# Altium project Vixen.PrjPcb
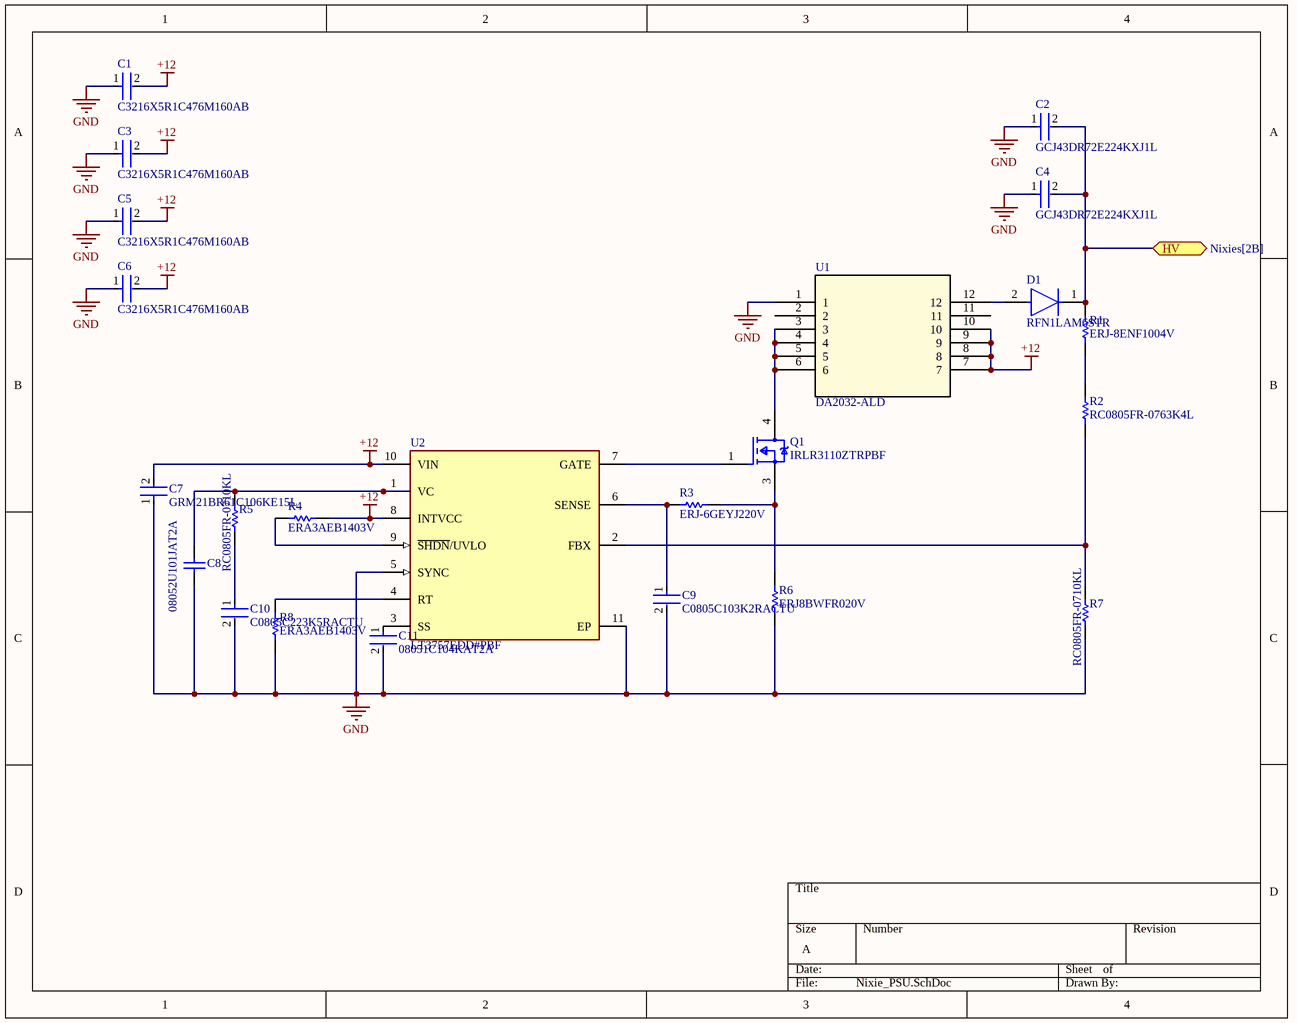
[diagram p0: Nixie_PSU.SchDoc]
5 sheets, 90 parts. Net scope: flat (ports and power ports of the same name join across sheets).
Board file: Vixen.PcbDoc
Sheets:
  Nixie_PSU.SchDoc
  Connectors.SchDoc
  Power.SchDoc
  Nixies.SchDoc
  ESP32.SchDoc

## Sheet Nixie_PSU.SchDoc
size A; SheetNumber: 1; SheetTotal: 5

### Parts
C1  C3216X5R1C476M160AB  [FP-C3216-160-0_2-MFG]
C2  GCJ43DR72E224KXJ1L  [FP-GCJ43D-0_4-IPC_C]
C3  C3216X5R1C476M160AB  [FP-C3216-160-0_2-MFG]
C4  GCJ43DR72E224KXJ1L  [FP-GCJ43D-0_4-IPC_C]
C5  C3216X5R1C476M160AB  [FP-C3216-160-0_2-MFG]
C6  C3216X5R1C476M160AB  [FP-C3216-160-0_2-MFG]
C7  GRM21BR61C106KE15L  [FP-GRM21B-0_1-IPC_C]
C8  08052U101JAT2A  [CAPC2013X115X51ML20T26]
C9  C0805C103K2RACTU  [FP-C0805C-DN-MFG]
C10  C0805C223K5RACTU  [FP-C0805C-DN-MFG]
C11  08051C104KAT2A  [FP-0805-L_2_01_0_2-W_1_25-IPC_B]
D1  RFN1LAM6STR  [FP-PMDTM-MFG]
Q1  IRLR3110ZTRPBF  [FP-PG-TO252-3-MFG]
R1  ERJ-8ENF1004V  [RESC3216X70X50NL05T20]
R2  RC0805FR-0763K4L  [RESC2013X60X35NL10T20]
R3  ERJ-6GEYJ220V  [RESC2013X70X40ML20T20]
R4  ERA3AEB1403V  [RESC1608X55X30LL20T20]
R5  RC0805FR-0710KL  [RESC2013X60X35NL10T20]
R6  ERJ8BWFR020V  [RESC3216X70X50LL05T20]
R7  RC0805FR-0710KL  [RESC2013X60X35NL10T20]
R8  ERA3AEB1403V  [RESC1608X55X30LL20T20]
U1  DA2032-ALD  [SOIC12_LT3750_DA2032_14P98X17P2_COC]
U2  LT3757EDD#PBF  [FP-DD-10-05-08-1699-IPC_A]

### Ports
HV (bidir, see Nixies[2B])

### Nets
+12: C1.2 C3.2 C5.2 C6.2 C7.2 R4.1 U1.7 U1.8 U1.9 U1.10 U2.8(INTVCC) U2.10(VIN)
GND: C1.1 C2.1 C3.1 C4.1 C5.1 C6.1 C7.1 C8.1 C9.2 C10.2 C11.2 R6.1 R7.1 R8.2 U1.1 U2.5(SYNC) U2.11(EP)
NetC2_2: C2.2 C4.2 D1.1(C) R1.2 ; port HV
NetC8_2: C8.2 R5.2 U2.1(VC)
NetC9_1: C9.1 R3.1 U2.6(SENSE)
NetC10_1: C10.1 R5.1
NetC11_1: C11.1 U2.3(SS)
NetD1_2: D1.2(A) U1.12
NetQ1_1: Q1.1(G) U2.7(GATE)
NetQ1_3: Q1.3(S) R3.2 R6.2
NetQ1_4: Q1.4(D) U1.3 U1.4 U1.5 U1.6
NetR1_1: R1.1 R2.2
NetR2_1: R2.1 R7.2 U2.2(FBX)
NetR4_2: R4.2 U2.9(~{SHDN}/UVLO)
NetR8_1: R8.1 U2.4(RT)

Not connected (* = marked no-connect by the designer): U1 2 11

### Library data of the parts
C1 C3 C5 C6 = CMP-2000-07442-2: Multilayer Ceramic Capacitors 47uF ±20% 16V X5R SMD 1206; Resistor Type: Ceramic; Width: 0.063inch; Case Code (Imperial): 1206; Radiation Hardening: No; Thickness: 0.071inch; Dielectric: X5R; Weight: 0.000571oz; Termination: SMD/SMT; Dielectric Material: Ceramic; Min Operating Temperature: -55°C; Depth: 1.6mm; Case Code (Metric): 3216; Max Operating Temperature: 85°C; RoHS Compliant: Yes; REACH SVHC: No SVHC; Mount: Surface Mount; Lead Free: Lead Free; Height: 1.6mm; Length: 3.2mm; Tolerance: 20%; Voltage Rating (DC): 16V; Capacitance: 47uF; Package Quantity: 1; Construction: Flat; Packaging: Tape and Reel; Series: C; Case/Package: 1206; Voltage Rating: 16V
C2 C4 = CMP-06035-007963-1: 0.22uF ±10% 250V Ceramic Capacitor X7R 1812 (4532 Metric); Capacitance: 220nF; Ratings: AEC-Q200; Dielectric: X7R; Voltage Rating: 250V; Termination: SMD/SMT; Tolerance: 10%; Width: 0.126inch; Length: 4.5mm; Radiation Hardening: No; Case Code (Metric): 4532; Voltage Rating (DC): 250V; Depth: 3.2mm; Features: Soft Termination; Mount: Surface Mount; Thickness: 0.079inch; REACH SVHC: No SVHC; Max Operating Temperature: 125°C; Package Quantity: 1; Case Code (Imperial): 1812; Min Operating Temperature: -55°C; Packaging: Tape and Reel; Case/Package: 1812; Height: 2mm
C7 = CMP-2007-03453-2: Chip Multilayer Ceramic Capacitors for General Purpose, 0805, 10uF, X5R, 15%, 10%, 16V; Radiation Hardening: No; Thickness: 0.053inch; Voltage Rating (DC): 16V; Lead Free: Lead Free; Package Quantity: 1; Width: 1.25mm; Case Code (Imperial): 0805; Depth: 1.25mm; Packaging: Tape and Reel; Dielectric: X5R; Max Operating Temperature: 85°C; Tolerance: 10%; Voltage Rating: 16V; Voltage: 16V; Capacitance: 10uF; Height: 1.25mm; Case Code (Metric): 2012; Material: Ceramic; Mount: Surface Mount; Case/Package: 0805; REACH SVHC: No SVHC; Length: 2mm; Min Operating Temperature: -55°C; Termination: SMD/SMT
C8 = CMP-2007-04861-1: Manufacturer: AVX Interconnect / Elco; Part Number: 08052U101JAT2A
C9 = CMP-2007-00259-2: CAP CER 10000PF 200V X7R 0805; Manufacturer: KEMET; Material: Ceramic; Temperature Coefficient: 30ppm/°C; Capacitance: 10,000 pF; Tolerance: 0.1; Value: 10,000 pF; Device Class L2: Capacitors; Voltage Rating: 200 V; Temperature Range High: +125°C; ComponentLink2Description: Datasheet; Height: 0.88mm; Octopart: https://octopart.com/c0805c103k2ractu-kemet-9138347; ComponentLink2URL: https://content.kemet.com/datasheets/KEM_C1003_C0G_SMD.pdf; Category: Cap; Temperature: -55°C to +125°C; Temperature Range Low: -55°C; Digikey Description: CAP CER 10000PF 200V X7R 0805; Manufacturer Part Number: C0805C103K2RACTU; Temperature Characteristic: X7R; Automotive: No; Device Class L3: Ceramic Capacitors; Mouser Description: KEMET - C0805C103K2RACTU - CAP, MLCC, X7R, 10NF, 200V, 0805; RoHS: TRUE; Device Class L1: Passive Components; Lead Free: Yes; Package: C0805C-DN; Ipc Land Pattern Name: CAPC200125X78
C10 = CMP-2007-00338-2: CAP CER 0.022UF 50V X7R 0805; Manufacturer: KEMET; Value: 22,000 pF; Material: Ceramic; Tolerance: 0.1; Temperature Coefficient: 30ppm/°C; Automotive: No; Package: C0805C-DN; RoHS: TRUE; Height: 0.88mm; Lead Free: Yes; Temperature Range Low: -55°C; Digikey Description: CAP CER 0.022UF 50V X7R 0805; ComponentLink2Description: Datasheet; Capacitance: 22,000 pF; Mouser Description: Capacitor; Ceramic; Cap; .022uF; Tol 10%; SMT; Vol-Rtg 50V; X7R; Tape and Reel; Device Class L3: Ceramic Capacitors; Category: Cap; Voltage Rating: 50 V; Temperature Characteristic: X7R; Ipc Land Pattern Name: CAPC200125X78; Manufacturer Part Number: C0805C223K5RACTU; Octopart: https://octopart.com/c0805c223k5ractu-kemet-145968; Device Class L1: Passive Components; Temperature: -55°C to +125°C; ComponentLink2URL: https://content.kemet.com/datasheets/KEM_C1003_C0G_SMD.pdf; Temperature Range High: +125°C; Device Class L2: Capacitors
C11 = CMP-2007-04174-2: General Purpose Ceramic Capacitor, 0805, 100nF, 10%, X7R, 15%, 100V; Packaging: Tape and Reel; Min Operating Temperature: -55°C; Dielectric Material: Ceramic; Height: 1.4mm; Voltage Rating: 100V; Termination: SMD/SMT; Case Code (Imperial): 0805; Case Code (Metric): 2012; Case/Package: 0805; Construction: Flat; Radiation Hardening: No; Series: -; Dielectric: X7R; Package Quantity: 2000; Mount: Surface Mount; Capacitance: 100nF; Contact Plating: Tin; Voltage: 100V; Lead Free: Lead Free; Depth: 1.25mm; RoHS Compliant: Yes; Number of Pins: 2; Max Operating Temperature: 125°C; Length: 2.01mm; Voltage Rating (DC): 100V; Thickness: 0.055inch; REACH SVHC: No SVHC; Width: 0.049inch; Tolerance: 10%
D1 = CMP-08972-000003-1: DIODE GEN PURP 600V 800MA PMDTM; Manufacturer: Rohm; Max Junction Temp: +150°C; Forward Current: 0.8A; Max Surge Forward Current: 15A; Peak Reverse Current: 1uA; Lead Free: Yes; ComponentLink2Description: Datasheet; Manufacturer Part Number: RFN1LAM6STR; Height: 1.05mm; Temperature: to +150°C; Device Class L2: Diodes; Temperature Range High: +150°C; ComponentLink2URL: https://www.rohm.com/datasheet/RFN1LAM6S/rfn1lam6s-e; Reverse Voltage: 600V; Category: Diode; Automotive: No; Octopart: https://octopart.com/rfn1lam6str-rohm-81877486; Package: PMDTM; Device Class L3: Rectifier Diodes; Max Repetitive Reverse Voltage: 600V; Device Class L1: Discrete Semiconductors; RoHS: TRUE; Digikey Description: DIODE GEN PURP 600V 800MA PMDTM
Q1 = CMP-32901-000150-1: MOSFET N-CH 100V 42A DPAK; Manufacturer: Infineon; Turn Off Delay Time: 33ns; Drain To Source Resistance: 12mΩ; Max Forward Diode Voltage: 1.3V; Reverse Recovery Time: 34ns; Number Of N Channels: 1; Power Dissipation: 140W; Turn On Delay Time: 24ns; Input Capacitace At Vds: 3980pF @ 25V; Max Junction Temp: +175°C; Rthja Max: 40°C/W; Threshold Vgs Max: 2.5V; Threshold Vgs Min: 1V; Reverse Recovery Charge: 42nC; Gate Charge At Vgs: 34nC @ 4.5V; Gate To Source Voltage: 16V; Depletion Mode: False; Pulse Drain Current: 250A; Drain To Source Breakdown Voltage: 100V; Temperature Range Low: -55°C; Continuous Drain Current: 42A; Temperature: -55°C to +175°C; Automotive: No; Footprint Url: https://www.infineon.com/dgdl/po-dpak.pdf?fileId=5546d462580663ef0158068dbd7a01d5; Package: PG-TO252-3; Drain To Source Voltage: 100V; ComponentLink2Description: Datasheet; Device Class L2: Transistors; Lead Free: Yes; Temperature Range High: +175°C; Octopart: https://octopart.com/irlr3110ztrpbf-infineon-65875028; Device Class L1: Discrete Semiconductors; Device Class L3: MOSFETs; RoHS: TRUE; Number Of Channels: 1; Manufacturer Part Number: IRLR3110ZTRPBF; Category: Trans; ComponentLink2URL: https://www.infineon.com/dgdl/irlr3110zpbf.pdf?fileId=5546d462533600a40153566cf6e2268a; Digikey Description: MOSFET N-CH 100V 42A DPAK; Height: 2.52mm
R1 = CMP-2003-00020-1: Manufacturer: Panasonic; Part Number: ERJ-8ENF1004V
R2 = CMP-2001-01229-1: Manufacturer: Yageo; Part Number: RC0805FR-0763K4L
R3 = CMP-2001-00374-1: Manufacturer: Panasonic; Part Number: ERJ-6GEYJ220V
R4 R8 = CMP-2000-00911-1: Manufacturer: Panasonic; Part Number: ERA3AEB1403V
R5 R7 = CMP-1659-00013-4: Chip Resistor, 10 KOhm, +/- 1%, 0.125 W, -55 to 155 degC, 0805 (2012 Metric), RoHS, Tape and Reel; Manufacturer: Yageo; Voltage Rating: 150 V; Mount: Surface Mount; ComponentLink1Description: Manufacturer URL; ComponentLink2URL: http://www.yageo.com/documents/recent/PYu-RC_Group_51_RoHS_L_04.pdf; Pins: 2; Length: 2 mm; Min Operating Temperature: -55 degC; Height: 0.5 mm; Mounting Technology: Surface Mount; RoHSCompliant: true; REACH SVHC: No SVHC; ComponentLink1URL: http://www.yageo.com/; Max Operating Temperature: 155 degC; PackageReference: 0805; DatasheetVersion: Rev. 4, 02/2016; Package Quantity: 5000; Packaging: Tape and Reel; ComponentLink2Description: Datasheet; PackageDescription: 2-Pin Surface Mounted Device, Body 2 x 1.25 mm
R6 = CMP-2003-00770-1: Manufacturer: Panasonic; Part Number: ERJ8BWFR020V
U1 = CMP-080-000000-1: No Description Available; Mfr_Name: Coilcraft; Source: DA2032-ALD.SchLib; RefDes: RefDes; Type: Type; Design Item ID: DA2032-ALD
U2 = CMP-09139-000444-1: IC REG CTRLR MULT TOPOLOGY 10DFN; Max Input Voltage: 40V; Number of Output Phases: 1; Min Supply Voltage: 2.9V; Switching Frequency: 1MHz; Min Output Voltage: 1.569V; Max Output Voltage: 350V; Clock Sync: Yes; Output Current: 25A; Topology: Boost; Max Output Current: 12uA; Synchronous Rectifier: No; Height: 0.7mm; Number of Outputs: 1; Packaging: Rail/Tube; Max Supply Voltage: 40V; Min Operating Temperature: -40°C; Output Voltage: 350V; RoHS Compliant: Yes; Mount: Surface Mount; Number of Pins: 10; REACH SVHC: No SVHC; Width: 3mm; Case/Package: DFN; Min Input Voltage: 2.9V; Package Quantity: 121; Length: 3mm; Max Operating Temperature: 125°C

## Sheet Connectors.SchDoc
size A; SheetNumber: 2; SheetTotal: 5
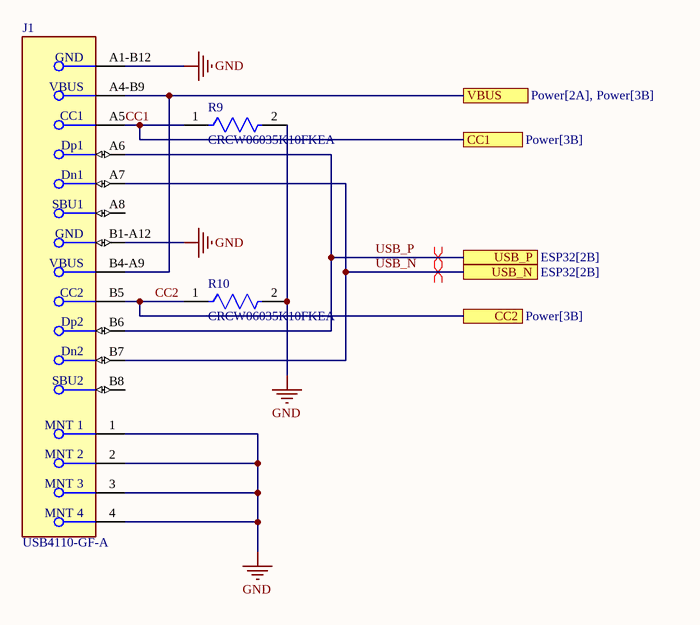
[diagram p1: Connectors.SchDoc]

### Parts
J1  USB4110-GF-A  [FP-USB4110-GF-A-MFG]
R9  CRCW06035K10FKEA  [FP-CRCW0603-e3-IPC_C]
R10  CRCW06035K10FKEA  [FP-CRCW0603-e3-IPC_C]

### Ports
CC1 (see Power[3B]), CC2 (see Power[3B]), USB_N (see ESP32[2B]), USB_P (see ESP32[2B]), VBUS (see Power[2A], Power[3B])

### Nets
GND: J1.1(MNT_1) J1.2(MNT_2) J1.3(MNT_3) J1.4(MNT_4) J1.A1-B12(GND) J1.B1-A12(GND) R9.2 R10.2
CC1: J1.A5(CC1) R9.1 ; port CC1
CC2: J1.B5(CC2) R10.1 ; port CC2
USB_N: J1.A7(Dn1) J1.B7(Dn2) ; port USB_N
USB_P: J1.A6(Dp1) J1.B6(Dp2) ; port USB_P
NetJ1_A4-B9: J1.A4-B9(VBUS) J1.B4-A9(VBUS) ; port VBUS

Not connected (* = marked no-connect by the designer): J1 A8(SBU1) B8(SBU2)

### Layout directives
differential pair: USB_N, USB_P

### Library data of the parts
J1 = CMP-245163-000002-1: CONN USB 2.0 TYPE-C R/A SMT; Manufacturer: GCT; Conn Orientation: Right Angle; Usb Standard: USB 2.0; Voltage Rating: 20V; Current Rating: 3/4.25/1.25/0.25A; Number Of Contacts: 16; Is Female: yes; Shielding: true; Standoff Height: 0.1mm; Octopart: https://octopart.com/usb4110-gf-a-gct-103941985; Temperature: -40°C to +85°C; RoHS: TRUE; Automotive: No; Contact Material: Gold,Nickel; Device Class L1: Connectors; Device Class L2: USB Connectors; Package: 0; Lead Free: Yes; ComponentLink2URL: https://gct.co/files/drawings/usb4110.pdf; Temperature Range High: +85°C; Temperature Range Low: -40°C; Height: 3.46mm; Manufacturer Part Number: USB4110-GF-A; ComponentLink2Description: Datasheet; Device Class L3: unset; Digikey Description: CONN USB 2.0 TYPE-C R/A SMT; Category: Conn
R9 R10 = CMP-1012-00590-3: RES Thick Film, 5.1kΩ, 1%, 0.1W, 100ppm/°C, 0603; Power Rating: 100mW; Voltage Rating (DC): 75V; Resistance: 5.1kR; Width: 0.85mm; Depth: 0.85mm; Military Standard: Not; Package Quantity: 5000; Case Code (Metric): 1608; Length: 1.55mm; Weight: 7.1E-05oz; Packaging: Tape and Reel; Temperature Coefficient: 100ppm/°C; Case Code (Imperial): 0603; Lead Free: Lead Free; Radiation Hardening: No; Contact Plating: Tin; Composition: Thick Film; Max Operating Temperature: 155°C; Termination: SMD/SMT; Case/Package: 0603; Min Operating Temperature: -55°C; Tolerance: 1%; Voltage Rating: 75V; Mount: Surface Mount; Height: 0.45mm

## Sheet Power.SchDoc
size A; SheetNumber: 3; SheetTotal: 5
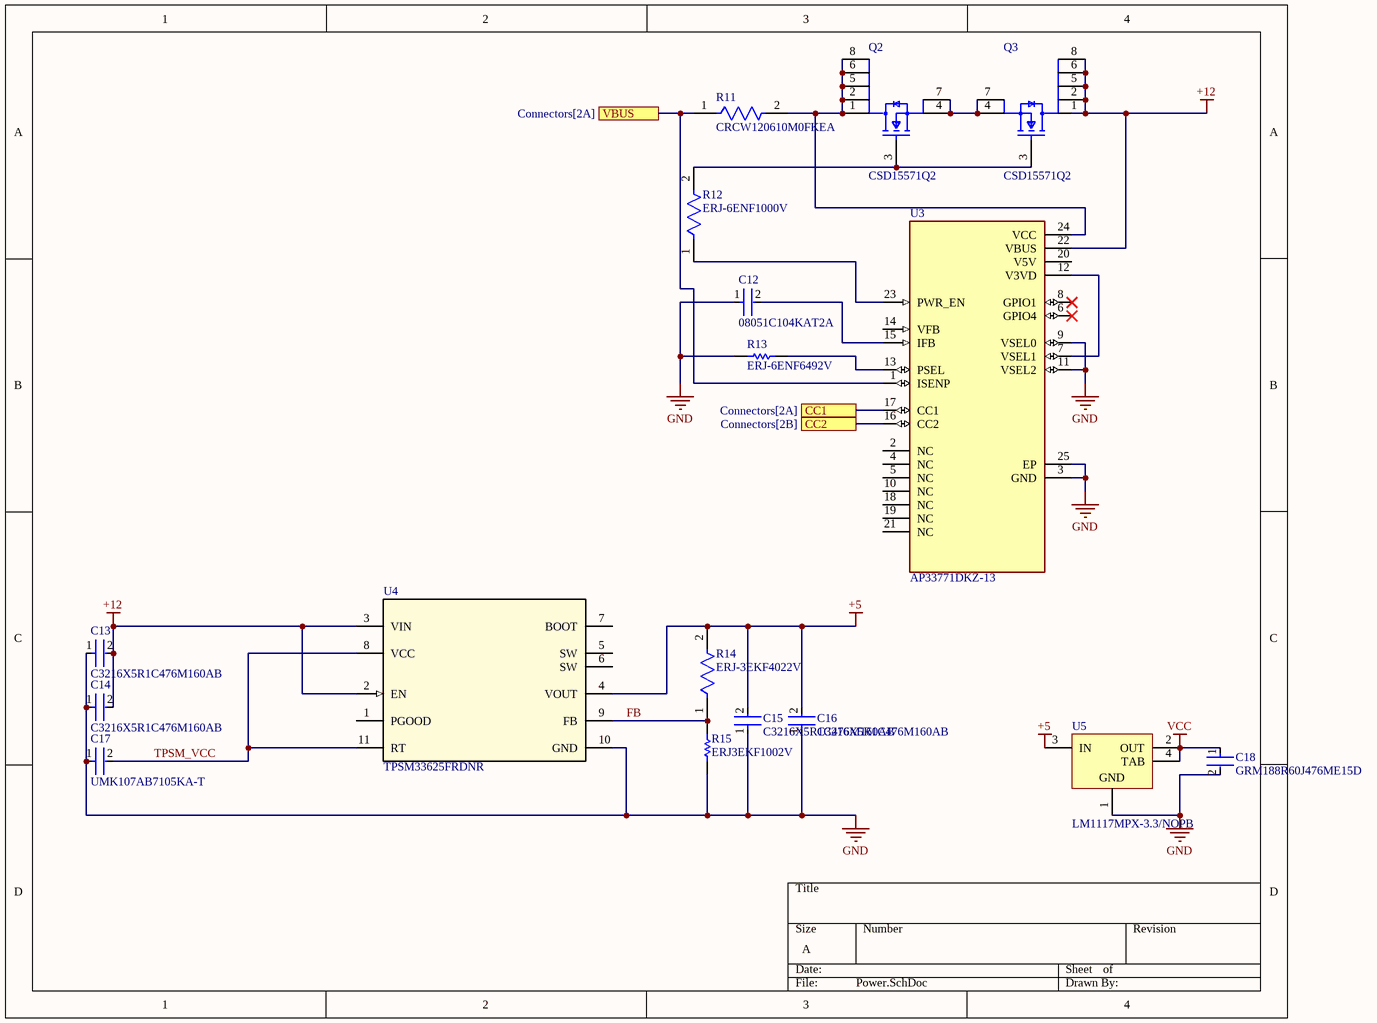
[diagram p2: Power.SchDoc]

### Parts
C12  08051C104KAT2A  [FP-0805-L_2_01_0_2-W_1_25-IPC_B]
C13  C3216X5R1C476M160AB  [FP-C3216-160-0_2-MFG]
C14  C3216X5R1C476M160AB  [FP-C3216-160-0_2-MFG]
C15  C3216X5R1C476M160AB  [FP-C3216-160-0_2-MFG]
C16  C3216X5R1C476M160AB  [FP-C3216-160-0_2-MFG]
C17  UMK107AB7105KA-T  [FP-0603-L_1_6_0_15-W_0_8-IPC_C]
C18  GRM188R60J476ME15D  [FP-GRM188-0_2-IPC_B]
Q2  CSD15571Q2  [FP-DQK0006C-MFG]
Q3  CSD15571Q2  [FP-DQK0006C-MFG]
R11  CRCW120610M0FKEA  [FP-CRCW1206-e3-IPC_B]
R12  ERJ-6ENF1000V  [FP-ERJ6EN-MFG]
R13  ERJ-6ENF6492V  [RESC2013X70X40LL20T20]
R14  ERJ-3EKF4022V  [FP-ERJ3EK-IPC_C]
R15  ERJ3EKF1002V  [RESC1609X55X30LL15T15]
U3  AP33771DKZ-13  [IC_AP33771DKZ-13]
U4  TPSM33625FRDNR  [RDN0011A-MFG]
U5  LM1117MPX-3.3/NOPB  [DCY0004A_L]

### Ports
CC1 (see Connectors[2A]), CC2 (see Connectors[2B]), VBUS (see Connectors[2A])

### Nets
+5: C15.2 C16.2 R14.2 U4.4(VOUT) U5.3(IN)
+12: C13.2 C14.2 Q3.1(D) Q3.2(D) Q3.5(D) Q3.6(D) Q3.8(D) U3.22(VBUS) U4.2(EN) U4.3(VIN)
GND: C12.1 C13.1 C14.1 C15.1 C16.1 C17.1 C18.2 R13.1 R15.1 U3.3(GND) U3.9(VSEL0) U3.11(VSEL2) U3.25(EP) U4.10(GND) U5.1(GND)
VCC: C18.1 U5.2(OUT) U5.4(TAB)
CC1: U3.17(CC1) ; port CC1
CC2: U3.16(CC2) ; port CC2
FB: R14.1 R15.2 U4.9(FB)
TPSM_VCC: C17.2 U4.8(VCC) U4.11(RT)
NetC12_2: C12.2 U3.15(IFB)
NetJ1_A4-B9: R11.1 U3.1(ISENP) ; port VBUS
NetQ2_1: Q2.1(D) Q2.2(D) Q2.5(D) Q2.6(D) Q2.8(D) R11.2 U3.24(VCC)
NetQ2_3: Q2.3(G) Q3.3(G) R12.2
NetQ2_4: Q2.4(S) Q2.7(S) Q3.4(S) Q3.7(S)
NetR12_1: R12.1 U3.23(PWR_EN)
NetR13_2: R13.2 U3.13(PSEL)
NetU3_7: U3.7(VSEL1) U3.12(V3VD)

Not connected (* = marked no-connect by the designer): U3 2(NC) 4(NC) 5(NC) 6(GPIO4)* 8(GPIO1)* 10(NC) 14(VFB) 18(NC) 19(NC) 20(V5V) 21(NC); U4 1(PGOOD) 5(SW) 6(SW) 7(BOOT)

### Library data of the parts
C12 = CMP-2007-04174-2: as C11 on sheet Nixie_PSU; Packaging: Tape and Reel; Min Operating Temperature: -55°C; Dielectric Material: Ceramic; Height: 1.4mm; Voltage Rating: 100V; Termination: SMD/SMT; Case Code (Imperial): 0805; Case Code (Metric): 2012; Case/Package: 0805; Construction: Flat; Radiation Hardening: No; Series: -; Dielectric: X7R; Package Quantity: 2000; Mount: Surface Mount; Capacitance: 100nF; Contact Plating: Tin; Voltage: 100V; Lead Free: Lead Free; Depth: 1.25mm; RoHS Compliant: Yes; Number of Pins: 2; Max Operating Temperature: 125°C; Length: 2.01mm; Voltage Rating (DC): 100V; Thickness: 0.055inch; REACH SVHC: No SVHC; Width: 0.049inch; Tolerance: 10%
C13-C16 = CMP-2000-07442-2: as C1 on sheet Nixie_PSU; Resistor Type: Ceramic; Width: 0.063inch; Case Code (Imperial): 1206; Radiation Hardening: No; Thickness: 0.071inch; Dielectric: X5R; Weight: 0.000571oz; Termination: SMD/SMT; Dielectric Material: Ceramic; Min Operating Temperature: -55°C; Depth: 1.6mm; Case Code (Metric): 3216; Max Operating Temperature: 85°C; RoHS Compliant: Yes; REACH SVHC: No SVHC; Mount: Surface Mount; Lead Free: Lead Free; Height: 1.6mm; Length: 3.2mm; Tolerance: 20%; Voltage Rating (DC): 16V; Capacitance: 47uF; Package Quantity: 1; Construction: Flat; Packaging: Tape and Reel; Series: C; Case/Package: 1206; Voltage Rating: 16V
C17 = CMP-2000-07531-4: Ceramic Capacitor General Use 1uF ±10% 50V X7R 0603; Series: M; Width: 0.031inch; Mount: Surface Mount; Radiation Hardening: No; Voltage Rating (DC): 50V; Packaging: Tape and Reel; Termination: SMD/SMT; Depth: 0.8mm; Case Code (Metric): 1608; Case Code (Imperial): 0603; Height: 0.8mm; Voltage Rating: 50V; Package Quantity: 1; Halogen Free: Halogen Free; Dielectric: X7R; Min Operating Temperature: -55°C; Length: 1.6mm; Construction: Flat; Tolerance: 10%; Thickness: 0.037inch; Max Operating Temperature: 125°C; Case/Package: 0603; Capacitance: 1uF; RoHS Compliant: Yes
C18 = CMP-2000-05444-2: Chip Multilayer Ceramic Capacitors for General Purpose, 0603, 47uF, X5R, 15%, 20%, 6.3V; Voltage Rating (DC): 6.3V; Thickness: 0.039inch; Case Code (Imperial): 0603; Packaging: Tape and Reel; Capacitance: 47uF; Width: 0.031inch; Dielectric: X5R; Max Operating Temperature: 85°C; Mount: Surface Mount; Case Code (Metric): 1608; Length: 0.063inch; Voltage Rating: 6.3V; Tolerance: 20%; Case/Package: 0603; Min Operating Temperature: -55°C
Q2 Q3 = CMP-04962-000051-1: MOSFET N-CH 20V 22A 6SON; Rds On Max: 15mR; Power Dissipation: 2.5W; Turn-Off Delay Time: 9.9ns; Number of Elements: 2; Number of Channels: 1; Turn-On Delay Time: 17.2ns; Input Capacitance: 419pF; Fall Time: 4.1ns; Drain to Source Resistance: 19.2mR; Element Configuration: Single; Contact Plating: Tin; Drain to Source Voltage (Vdss): 20V; Number of Pins: 6; Max Power Dissipation: 2.5W; Min Operating Temperature: -55°C; Max Operating Temperature: 150°C; Packaging: Tape and Reel; Rise Time: 17.2ns; Mount: Surface Mount; Gate to Source Voltage (Vgs): 20V; Drain to Source Breakdown Voltage: 20V; Lead Free: Lead Free; Continuous Drain Current (ID): 22A; Package Quantity: 3000
R11 = CMP-1014-00962-3: RES Thick Film, 10MΩ, 1%, 0.25W, 100ppm/°C, 1206; Working Voltage: 200V; Power Rating: 250mW; Resistance: 10MR; Height: 0.024inch; Length: 3.2mm; Packaging: Tape and Reel; Lead Free: Lead Free; Composition: Thick Film; Tolerance: 1%; Max Operating Temperature: 155°C; Depth: 1.6mm; Temperature Coefficient: 100ppm/°C; Termination: SMD/SMT; Max Power Dissipation: 250mW; Number of Terminations: 2; Weight: 0.000353oz; Voltage Rating (DC): 200V; Min Operating Temperature: -55°C; Case/Package: 1206; Military Standard: Not; Voltage Rating: 200V; Radiation Hardening: No; Case Code (Imperial): 1206; Case Code (Metric): 3216; Width: 0.063inch; Package Quantity: 10; Contact Plating: Tin; Features: Automotive AEC-Q200
R12 = CMP-2001-04374-6: RES SMD 100 OHM 1% 1/8W 0805; Resistance: 100R; Temperature Coefficient: 100ppm/°C; Voltage Rating (DC): 150V; Max Power Dissipation: 125mW; Case Code (Imperial): 0805; Termination: SMD/SMT; Number of Pins: 2; Case Code (Metric): 2012; Resistor Type: Thick Film; Lead Free: Lead Free; Series: ERJ; Size Code: 0805; Min Operating Temperature: -55°C; RoHS Compliant: Yes; Radiation Hardening: No; Technology: THICK FILM; Contact Plating: Tin; Length: 2mm; Resistance Tolerance: 1%; Military Standard: Not; Case/Package: 0805; REACH SVHC: No SVHC; Max Operating Temperature: 155°C; Construction: Rectangular; Packaging: Tape and Reel; Tolerance: 1%; Voltage Rating: 150V; Power Rating: 125mW; Depth: 1.25mm; Width: 1.2mm; Package Quantity: 1; Mount: Surface Mount; Height: 0.6mm; Number of Terminations: 2; Features: Automotive AEC-Q200
R13 = CMP-2001-00264-1: Manufacturer: Panasonic; Part Number: ERJ-6ENF6492V
R14 = CMP-2000-00486-2: RES SMD 40.2K OHM 1% 1/10W 0603; Power Rating: 100mW; Resistance: 40.2kR; Voltage Rating: 75V; Temperature Coefficient: 100ppm/°C; Voltage Rating (DC): 50V; Military Standard: Not; Lead Free: Lead Free; Resistor Type: Thick Film; Weight: 7.1E-05oz; Resistance Tolerance: 1%; Number of Terminations: 2; Min Operating Temperature: -55°C; Depth: 0.8mm; Max Power Dissipation: 100mW; Length: 1.6mm; Case Code (Imperial): 0603; Max Operating Temperature: 155°C; Series: ERJ; Radiation Hardening: No; Features: Automotive AEC-Q200; Mount: Surface Mount; Package Quantity: 1; Packaging: Tape and Reel; Height: 0.45mm; Width: 0.031inch; RoHS Compliant: Yes; Case/Package: 0603; Tolerance: 1%; Contact Plating: Tin; Technology: THICK FILM; Construction: Rectangular; Case Code (Metric): 1608; Termination: SMD/SMT
R15 = CMP-1012-00623-3: Chip Resistor, 10 KOhm, +/- 1%, 0.1 W, -55 to 155 degC, 0603 (1608 Metric), RoHS, Tape and Reel; Manufacturer: Panasonic; Voltage Rating: 75V; Case\/Package: 0603; Power Rating: 100mW; Resistance: 10KOhm; Temperature Coefficient: 100ppm\/degreesC; Number of Pins: 2; Package Reference: 603; Depth: 0.8mm; Mount: SurfaceMount; Package Description: 2-Pin Surface Mount Device, Body 1.6 x 0.85 mm; Datasheet Version: 02/2017; Length: 1.6mm; Lead Free: LeadFree; Height: 0.45mm; Number of Terminations: 2; Max Power Dissipation: 100mW; Min Operating Temperature: -55degC; Datasheet URL: https://industrial.panasonic.com/cdbs/www-data/pdf/RDA0000/AOA0000C304.pdf; Termination: SMD/SMT; Case Code (Metric): 1608; Case Code (Imperial): 0603; Tolerance: 1%; Max Operating Temperature: 155degC; RoHSCompliant: true; Voltage Rating (DC): 75V; Radiation Hardening: No; Packaging: TapeandReel; Composition: ThickFilm; Mounting Technology: SurfaceMount; Manufacturer URL: http://www.panasonic.com/; Width: 0.031inch; REACH SVHC: NoSVHC; Contact Plating: Tin; Military Standard: Not; Package Quantity: 1
U3 = AP33771DKZ-13: MF: {'manufacturer': u'Diodes Incorporated'}; Package: None; Price: None; Value: *; MP: AP33771DKZ-13; Availability: Unavailable
U4 = CMP-054-000002-4: No Description Available; Mfr_Name: Texas Instruments; Design Item ID: TPSM33625FRDNR; Source: TPSM33625FRDNR.SchLib; TYPE: TYPE; RefDes: RefDes
U5 = CMP-0062-01639-4: 800mA Low-Dropout Linear Regulator, 4-pin SOT-223, Pb-Free; Manufacturer: Texas Instruments; High-Reliability: Y; PowerWise: N; PackageTopMarking: XYTT*N05A; CompType: LDO IC; ComponentLink1URL: http://www.ti.com/general/docs/lit/getliterature.tsp?genericPartNumber=LM1117-N&fileType=pdf; PartNumber: LM1117MPX-3.3/NOPB; ComponentLink1Description: Datasheet URL; PinCount: 4; Code_JEDEC: TO-261-AA; PackageDescription: Molded SOT-223, 6.50 x 3.56 x 1.6mm Body, 4 Lead, 2.3mm Pitch; PackageReference: DCY0004A; RoHS: Y; Code_IPC: SOT223-4

## Sheet Nixies.SchDoc
size B; SheetNumber: 4; SheetTotal: 5
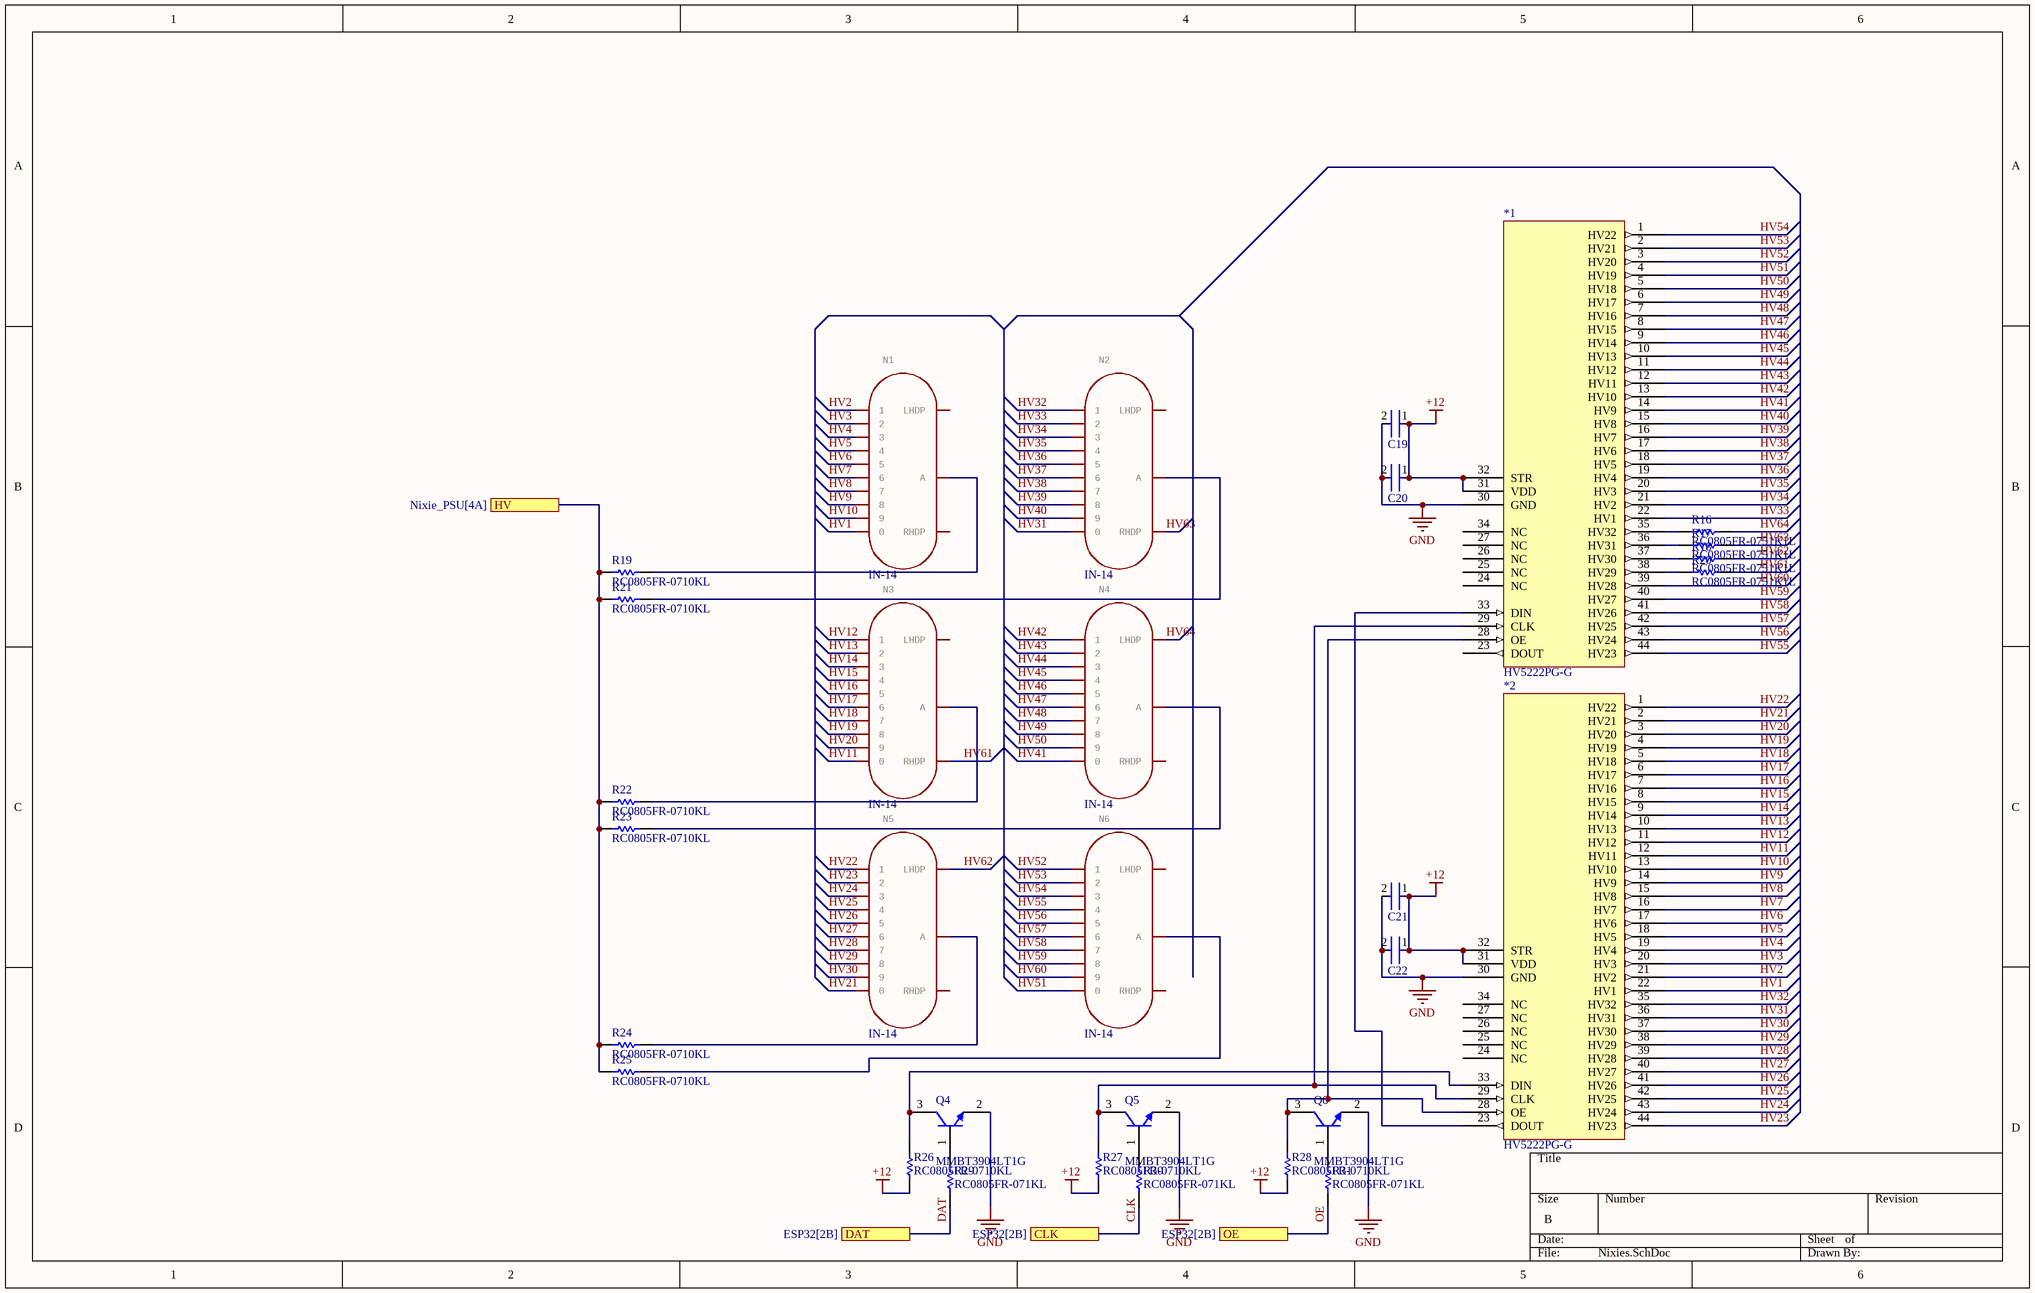
[diagram p3: Nixies.SchDoc]

### Parts
*1  HV5222PG-G  [QFP80P1390X1390X235-44N]
*2  HV5222PG-G  [QFP80P1390X1390X235-44N]
C19  GRM188R60J476ME15D  [FP-GRM188-0_2-IPC_B]  (value not drawn)
C20  GRM188R60J476ME15D  [FP-GRM188-0_2-IPC_B]  (value not drawn)
C21  GRM188R60J476ME15D  [FP-GRM188-0_2-IPC_B]  (value not drawn)
C22  GRM188R60J476ME15D  [FP-GRM188-0_2-IPC_B]  (value not drawn)
N1  IN-14  [IN-14]
N2  IN-14  [IN-14]
N3  IN-14  [IN-14]
N4  IN-14  [IN-14]
N5  IN-14  [IN-14]
N6  IN-14  [IN-14]
Q4  MMBT3904LT1G  [ONSC-SOT-23-3-318-08_V]
Q5  MMBT3904LT1G  [ONSC-SOT-23-3-318-08_V]
Q6  MMBT3904LT1G  [ONSC-SOT-23-3-318-08_V]
R16  RC0805FR-0751K1L  [RESC2013X60X35LL10T20]
R17  RC0805FR-0751K1L  [RESC2013X60X35LL10T20]
R18  RC0805FR-0751K1L  [RESC2013X60X35LL10T20]
R19  RC0805FR-0710KL  [RESC2013X60X35NL10T20]
R20  RC0805FR-0751K1L  [RESC2013X60X35LL10T20]
R21  RC0805FR-0710KL  [RESC2013X60X35NL10T20]
R22  RC0805FR-0710KL  [RESC2013X60X35NL10T20]
R23  RC0805FR-0710KL  [RESC2013X60X35NL10T20]
R24  RC0805FR-0710KL  [RESC2013X60X35NL10T20]
R25  RC0805FR-0710KL  [RESC2013X60X35NL10T20]
R26  RC0805FR-0710KL  [RESC2013X60X35NL10T20]
R27  RC0805FR-0710KL  [RESC2013X60X35NL10T20]
R28  RC0805FR-0710KL  [RESC2013X60X35NL10T20]
R29  RC0805FR-071KL  [RESC2013X60X35ML10T20]
R30  RC0805FR-071KL  [RESC2013X60X35ML10T20]
R31  RC0805FR-071KL  [RESC2013X60X35ML10T20]

### Ports
CLK (see ESP32[2B]), DAT (see ESP32[2B]), HV (see Nixie_PSU[4A]), OE (see ESP32[2B])

### Nets
+12: *1.31(VDD) *1.32(STR) *2.31(VDD) *2.32(STR) C19.1 C20.1 C21.1 C22.1 R26.1 R27.1 R28.1
GND: *1.30(GND) *2.30(GND) C19.2 C20.2 C21.2 C22.2 Q4.2(E) Q5.2(E) Q6.2(E)
CLK: R30.1 ; port CLK
DAT: R29.1 ; port DAT
HV1: *2.22(HV1) N1.0
HV2: *2.21(HV2) N1.1
HV3: *2.20(HV3) N1.2
HV4: *2.19(HV4) N1.3
HV5: *2.18(HV5) N1.4
HV6: *2.17(HV6) N1.5
HV7: *2.16(HV7) N1.6
HV8: *2.15(HV8) N1.7
HV9: *2.14(HV9) N1.8
HV10: *2.13(HV10) N1.9
HV11: *2.12(HV11) N3.0
HV12: *2.11(HV12) N3.1
HV13: *2.10(HV13) N3.2
HV14: *2.9(HV14) N3.3
HV15: *2.8(HV15) N3.4
HV16: *2.7(HV16) N3.5
HV17: *2.6(HV17) N3.6
HV18: *2.5(HV18) N3.7
HV19: *2.4(HV19) N3.8
HV20: *2.3(HV20) N3.9
HV21: *2.2(HV21) N5.0
HV22: *2.1(HV22) N5.1
HV23: *2.44(HV23) N5.2
HV24: *2.43(HV24) N5.3
HV25: *2.42(HV25) N5.4
HV26: *2.41(HV26) N5.5
HV27: *2.40(HV27) N5.6
HV28: *2.39(HV28) N5.7
HV29: *2.38(HV29) N5.8
HV30: *2.37(HV30) N5.9
HV31: *2.36(HV31) N2.0
HV32: *2.35(HV32) N2.1
HV33: *1.22(HV1) N2.2
HV34: *1.21(HV2) N2.3
HV35: *1.20(HV3) N2.4
HV36: *1.19(HV4) N2.5
HV37: *1.18(HV5) N2.6
HV38: *1.17(HV6) N2.7
HV39: *1.16(HV7) N2.8
HV40: *1.15(HV8) N2.9
HV41: *1.14(HV9) N4.0
HV42: *1.13(HV10) N4.1
HV43: *1.12(HV11) N4.2
HV44: *1.11(HV12) N4.3
HV45: *1.10(HV13) N4.4
HV46: *1.9(HV14) N4.5
HV47: *1.8(HV15) N4.6
HV48: *1.7(HV16) N4.7
HV49: *1.6(HV17) N4.8
HV50: *1.5(HV18) N4.9
HV51: *1.4(HV19) N6.0
HV52: *1.3(HV20) N6.1
HV53: *1.2(HV21) N6.2
HV54: *1.1(HV22) N6.3
HV55: *1.44(HV23) N6.4
HV56: *1.43(HV24) N6.5
HV57: *1.42(HV25) N6.6
HV58: *1.41(HV26) N6.7
HV59: *1.40(HV27) N6.8
HV60: *1.39(HV28) N6.9
HV61: N3.RHDP R20.2
HV62: N5.LHDP R18.2
HV63: N2.RHDP R17.2
HV64: N4.LHDP R16.2
OE: R31.1 ; port OE
Net*1_28: *1.28(OE) *2.28(OE) Q6.3(C) R28.2
Net*1_29: *1.29(CLK) *2.29(CLK) Q5.3(C) R27.2
Net*1_33: *1.33(DIN) *2.23(DOUT)
Net*1_35: *1.35(HV32) R16.1
Net*1_36: *1.36(HV31) R17.1
Net*1_37: *1.37(HV30) R18.1
Net*1_38: *1.38(HV29) R20.1
Net*2_33: *2.33(DIN) Q4.3(C) R26.2
NetC2_2: R19.2 R21.2 R22.2 R23.2 R24.2 R25.2 ; port HV
NetN1_A: N1.A R19.1
NetN2_A: N2.A R21.1
NetN3_A: N3.A R22.1
NetN4_A: N4.A R23.1
NetN5_A: N5.A R24.1
NetN6_A: N6.A R25.1
NetQ4_1: Q4.1(B) R29.2
NetQ5_1: Q5.1(B) R30.2
NetQ6_1: Q6.1(B) R31.2

Not connected (* = marked no-connect by the designer): *1 23(DOUT) 24(NC) 25(NC) 26(NC) 27(NC) 34(NC); *2 24(NC) 25(NC) 26(NC) 27(NC) 34(NC); N1 LHDP RHDP; N2 LHDP; N3 LHDP; N4 RHDP; N5 RHDP; N6 LHDP RHDP

### Library data of the parts
*1 *2 = CMP-00024-00006-1: EL Driver, 32-Segment, PQFP44
C19-C22 = CMP-2000-05444-2: as C18 on sheet Power; Voltage Rating (DC): 6.3V; Thickness: 0.039inch; Case Code (Imperial): 0603; Packaging: Tape and Reel; Capacitance: 47uF; Width: 0.031inch; Dielectric: X5R; Max Operating Temperature: 85°C; Mount: Surface Mount; Case Code (Metric): 1608; Length: 0.063inch; Voltage Rating: 6.3V; Tolerance: 20%; Case/Package: 0603; Min Operating Temperature: -55°C
N1-N6 = CMP-087-000009-1: GateName_1: G$1; Design Item ID: IN-14; SymbolName_1: IN-14; LibraryName: nixies-us; DeviceSetName: IN-14; Package: IN-14; Source: nixies-us.SCHLIB
Q4-Q6 = CMP-1048-00631-1: General Purpose Transistor, NPN Silicon, 3-Pin SOT-23, Pb-Free, Tape and Reel; Manufacturer: On Semiconductor; IC Continuous (A): 0.2; fT Min (MHz): 300; ComponentLink2Description: Datasheet; Polarity: NPN; PackageDescription: 3-Pin Small Outline Transistor, Body 2.92 x 1.3 mm, Pitch 0.95 mm; ComponentLink2URL: http://www.onsemi.cn/pub_link/Collateral/MMBT3904LT1-D.PDF; DatasheetVersion: Rev. 12; Mounting Technology: Surface Mount; PartNumber: MMBT3904LT1G; ComponentLink1URL: http://www.onsemi.com/; ComponentLink3Description: Package Specification; ComponentLink1Description: Manufacturer URL; PackageVersion: Rev. AP, 11/2009; PackageReference: SOT-23-3-318-08; Packing: Tape and Reel; ComponentLink3URL: http://www.onsemi.cn/pub_link/Collateral/318-08.PDF; RoHS: TRUE
R16-R18 R20 = CMP-2001-01183-1: Manufacturer: Yageo; Part Number: RC0805FR-0751K1L
R19 R21-R28 = CMP-1659-00013-4: as R5 on sheet Nixie_PSU; Mount: Surface Mount; ComponentLink1Description: Manufacturer URL; ComponentLink2URL: http://www.yageo.com/documents/recent/PYu-RC_Group_51_RoHS_L_04.pdf; Pins: 2; Length: 2 mm; Min Operating Temperature: -55 degC; Height: 0.5 mm; Mounting Technology: Surface Mount; RoHSCompliant: true; REACH SVHC: No SVHC; ComponentLink1URL: http://www.yageo.com/; Max Operating Temperature: 155 degC; PackageReference: 0805; DatasheetVersion: Rev. 4, 02/2016; Package Quantity: 5000; Packaging: Tape and Reel; ComponentLink2Description: Datasheet; PackageDescription: 2-Pin Surface Mounted Device, Body 2 x 1.25 mm
R29-R31 = CMP-2100-03671-1: Chip Resistor, 1 KOhm, +/- 1%, 125 mW, -55 to 155 degC, 0805 (2012 Metric), RoHS, Tape and Reel; Manufacturer: Yageo; Temperature Coefficient: 100ppm/degreesC; Voltage Rating (DC): 150V; Max Power Dissipation: 125mW; Resistance: 1KOhm; Number of Pins: 2; Number of Terminations: 2; Datasheet URL: http://www.yageo.com/NewPortal/yageodocoutput?fileName=/pdf/R-Chip/PYu-RC_Group_51_RoHS_L_5.pdf; Length: 0.079inch; Package Description: 2-Pin Surface Mounted Device, Body 2 x 1.25 mm; Depth: 1.25mm; Height: 0.024inch; Military Standard: Not; Case/Package: 0805; Package Reference: 0805; RoHSCompliant: true; Lead Free: LeadFree; Packaging: TapeandReel; Package Quantity: 1; Datasheet Version: Rev. 5, 10/2016; Tolerance: 1%; Min Operating Temperature: -55degC; Voltage Rating: 150V; Composition: ThickFilm; Case Code (Imperial): 0805; Power Rating: 125mW; Width: 0.049inch; Case Code (Metric): 2012; Manufacturer URL: http://www.yageo.com/; Max Operating Temperature: 155degC; REACH SVHC: Unknown; Termination: SMD/SMT

## Sheet ESP32.SchDoc
size A; SheetNumber: 5; SheetTotal: 5
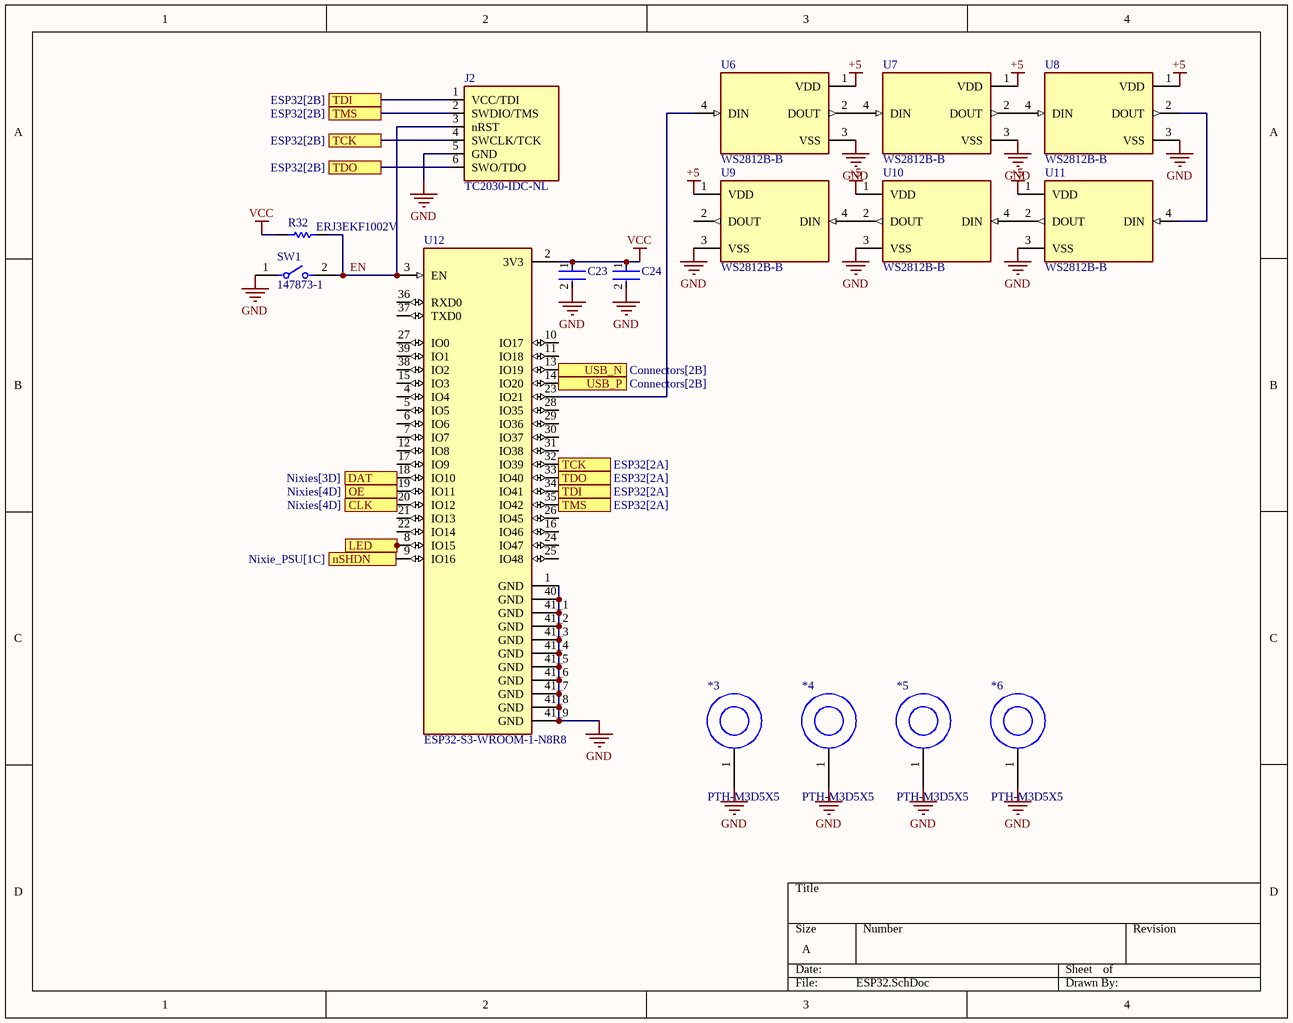
[diagram p4: ESP32.SchDoc]

### Parts
*3  PTH-M3D5X5  [PTH-M3D5X5-Footprint-1]
*4  PTH-M3D5X5  [PTH-M3D5X5-Footprint-1]
*5  PTH-M3D5X5  [PTH-M3D5X5-Footprint-1]
*6  PTH-M3D5X5  [PTH-M3D5X5-Footprint-1]
C23  GRM188R60J476ME15D  [FP-GRM188-0_2-IPC_B]  (value not drawn)
C24  GRM188R60J476ME15D  [FP-GRM188-0_2-IPC_B]  (value not drawn)
J2  TC2030-IDC-NL  [TAG_TC2030-IDC-NL]
R32  ERJ3EKF1002V  [RESC1609X55X30LL15T15]
SW1  147873-1  [FP-147873-1-MFG]
U6  WS2812B-B  [LED_WS2812B-B]
U7  WS2812B-B  [LED_WS2812B-B]
U8  WS2812B-B  [LED_WS2812B-B]
U9  WS2812B-B  [LED_WS2812B-B]
U10  WS2812B-B  [LED_WS2812B-B]
U11  WS2812B-B  [LED_WS2812B-B]
U12  ESP32-S3-WROOM-1-N8R8  [XCVR_ESP32S3WROOM1N8R8]

### Ports
CLK (see Nixies[4D]), DAT (see Nixies[3D]), LED, nSHDN (see Nixie_PSU[1C]), OE (see Nixies[4D]), TCK (see ESP32[2A]), TCK (see ESP32[2B]), TDI (see ESP32[2A]), TDI (see ESP32[2B]), TDO (see ESP32[2A]), TDO (see ESP32[2B]), TMS (see ESP32[2A]), TMS (see ESP32[2B]), USB_N (see Connectors[2B]), USB_P (see Connectors[2B])

### Nets
+5: U6.1(VDD) U7.1(VDD) U8.1(VDD) U9.1(VDD) U10.1(VDD) U11.1(VDD)
GND: *3.1 *4.1 *5.1 *6.1 C23.2 C24.2 J2.5(GND) SW1.1 U6.3(VSS) U7.3(VSS) U8.3(VSS) U9.3(VSS) U10.3(VSS) U11.3(VSS) U12.1(GND) U12.40(GND) U12.41_1(GND) U12.41_2(GND) U12.41_3(GND) U12.41_4(GND) U12.41_5(GND) U12.41_6(GND) U12.41_7(GND) U12.41_8(GND) U12.41_9(GND)
VCC: C23.1 C24.1 R32.2 U12.2(3V3)
CLK: U12.20(IO12) ; port CLK
DAT: U12.18(IO10) ; port DAT
EN: J2.3(nRST) R32.1 SW1.2 U12.3(EN)
OE: U12.19(IO11) ; port OE
USB_N: U12.13(IO19) ; port USB_N
USB_P: U12.14(IO20) ; port USB_P
NetJ2_1: J2.1(VCC/TDI) U12.34(IO41) ; port TDI
NetJ2_2: J2.2(SWDIO/TMS) U12.35(IO42) ; port TMS
NetJ2_4: J2.4(SWCLK/TCK) U12.32(IO39) ; port TCK
NetJ2_6: J2.6(SWO/TDO) U12.33(IO40) ; port TDO
NetU6_2: U6.2(DOUT) U7.4(DIN)
NetU6_4: U6.4(DIN) U12.23(IO21)
NetU7_2: U7.2(DOUT) U8.4(DIN)
NetU8_2: U8.2(DOUT) U11.4(DIN)
NetU9_4: U9.4(DIN) U10.2(DOUT)
NetU10_4: U10.4(DIN) U11.2(DOUT)
NetU12_8: U12.8(IO15) ; port LED
NetU12_9: U12.9(IO16) ; port nSHDN

Not connected (* = marked no-connect by the designer): U9 2(DOUT); U12 4(IO4) 5(IO5) 6(IO6) 7(IO7) 10(IO17) 11(IO18) 12(IO8) 15(IO3) 16(IO46) 17(IO9) 21(IO13) 22(IO14) 24(IO47) 25(IO48) 26(IO45) 27(IO0) 28(IO35) 29(IO36) 30(IO37) 31(IO38) 36(RXD0) 37(TXD0) 38(IO2) 39(IO1)

### Library data of the parts
*3-*6 = CMP-010-00024-1: Plated Thru-Hole M3 D5X5; Pins: 1; Mounting Technology: TH
C23 C24 = CMP-2000-05444-2: as C18 on sheet Power; Voltage Rating (DC): 6.3V; Thickness: 0.039inch; Case Code (Imperial): 0603; Packaging: Tape and Reel; Capacitance: 47uF; Width: 0.031inch; Dielectric: X5R; Max Operating Temperature: 85°C; Mount: Surface Mount; Case Code (Metric): 1608; Length: 0.063inch; Voltage Rating: 6.3V; Tolerance: 20%; Case/Package: 0603; Min Operating Temperature: -55°C
J2 = CMP-070-000001-2: CABLE ADAPTER 6 POS; Package: None; Price: None; Pin Count: 6; Component Type: Standard; Availability: Unavailable; MP: TC2030-IDC-NL; Design Item ID: TC2030-IDC-NL; Value: *; Source: TC2030-IDC-NL.SchLib
R32 = CMP-1012-00623-3: as R15 on sheet Power; Number of Pins: 2; Package Reference: 603; Depth: 0.8mm; Mount: SurfaceMount; Package Description: 2-Pin Surface Mount Device, Body 1.6 x 0.85 mm; Datasheet Version: 02/2017; Length: 1.6mm; Lead Free: LeadFree; Height: 0.45mm; Number of Terminations: 2; Max Power Dissipation: 100mW; Min Operating Temperature: -55degC; Datasheet URL: https://industrial.panasonic.com/cdbs/www-data/pdf/RDA0000/AOA0000C304.pdf; Termination: SMD/SMT; Case Code (Metric): 1608; Case Code (Imperial): 0603; Tolerance: 1%; Max Operating Temperature: 155degC; RoHSCompliant: true; Voltage Rating (DC): 75V; Radiation Hardening: No; Packaging: TapeandReel; Composition: ThickFilm; Mounting Technology: SurfaceMount; Manufacturer URL: http://www.panasonic.com/; Width: 0.031inch; REACH SVHC: NoSVHC; Contact Plating: Tin; Military Standard: Not; Package Quantity: 1
SW1 = CMP-03407-000005-1: SWITCH TACTILE SPST-NO 0.05A 24V; Manufacturer: TE Connectivity; Contact Resistance: 100mΩ; Operating Force: 180gf; Electromechanical Life: 40000Cycles; Contact Current Rating: 50mA; Throw Configuration: SPST-NO; Mouser Description: Switch Tactile OFF (ON) SPST Rectangular Button J-Bend 0.05A 24VDC 1.77N SMD T/R; Mount: Surface Mount; Height: 5.5mm; Category: Switch; RoHS: TRUE; Temperature Range High: +85°C; ComponentLink2Description: Datasheet; Temperature Range Low: -35°C; Device Class L1: Electromechanical; Device Class L2: Switches; Package: 0; Temperature: -35°C to +85°C; Device Class L3: Tactile Switches; Automotive: No; Manufacturer Part Number: 147873-1; ComponentLink2URL: https://www.te.com/commerce/DocumentDelivery/DDEController?Action=showdoc&DocId=Customer+Drawing%7F147873%7FK3%7Fpdf%7FEnglish%7FENG_CD_147873_K3.pdf%7F147873-1; Lead Free: Yes; Voltage Rating Dc: 24V; Octopart: https://octopart.com/147873-1-te+connectivity-40818451; Digikey Description: SWITCH TACTILE SPST-NO 0.05A 24V
U6-U11 = WS2812B-B: Intelligent control LED integrated light source; MF: {'manufacturer': u'Worldsemi'}; Package: None; Price: None; Value: *; MP: WS2812B-B; Availability: Unavailable
U12 = ESP32-S3-WROOM-1-N8R8: <a href="https://pricing.snapeda.com/parts/ESP32S3WROOM1N8R8/Espressif%20Systems/view-part?ref=eda">Check availability</a>; MF: {'manufacturer': u'Espressif Systems'}; Package: None; Price: None; Value: *; MP: ESP32-S3-WROOM-1-N8R8; Availability: Unavailable

## Nets that join several sheets
+5: Power (5 pins), ESP32 (6 pins)
+12: Nixie_PSU (12 pins), Power (10 pins), Nixies (11 pins)
GND: Nixie_PSU (17 pins), Connectors (8 pins), Power (15 pins), Nixies (9 pins), ESP32 (25 pins)
VCC: Power (C18.1 U5.2 U5.4), ESP32 (C23.1 C24.1 R32.2 U12.2)
CC1: Connectors (J1.A5 R9.1), Power (U3.17)
CC2: Connectors (J1.B5 R10.1), Power (U3.16)
CLK: Nixies (R30.1), ESP32 (U12.20)
DAT: Nixies (R29.1), ESP32 (U12.18)
NetC2_2: Nixie_PSU (C2.2 C4.2 D1.1 R1.2), Nixies (6 pins)
NetJ1_A4-B9: Connectors (J1.A4-B9 J1.B4-A9), Power (R11.1 U3.1)
OE: Nixies (R31.1), ESP32 (U12.19)
USB_N: Connectors (J1.A7 J1.B7), ESP32 (U12.13)
USB_P: Connectors (J1.A6 J1.B6), ESP32 (U12.14)